# EAGLE design RS232 Loopback (EAGLE 9.6.2)
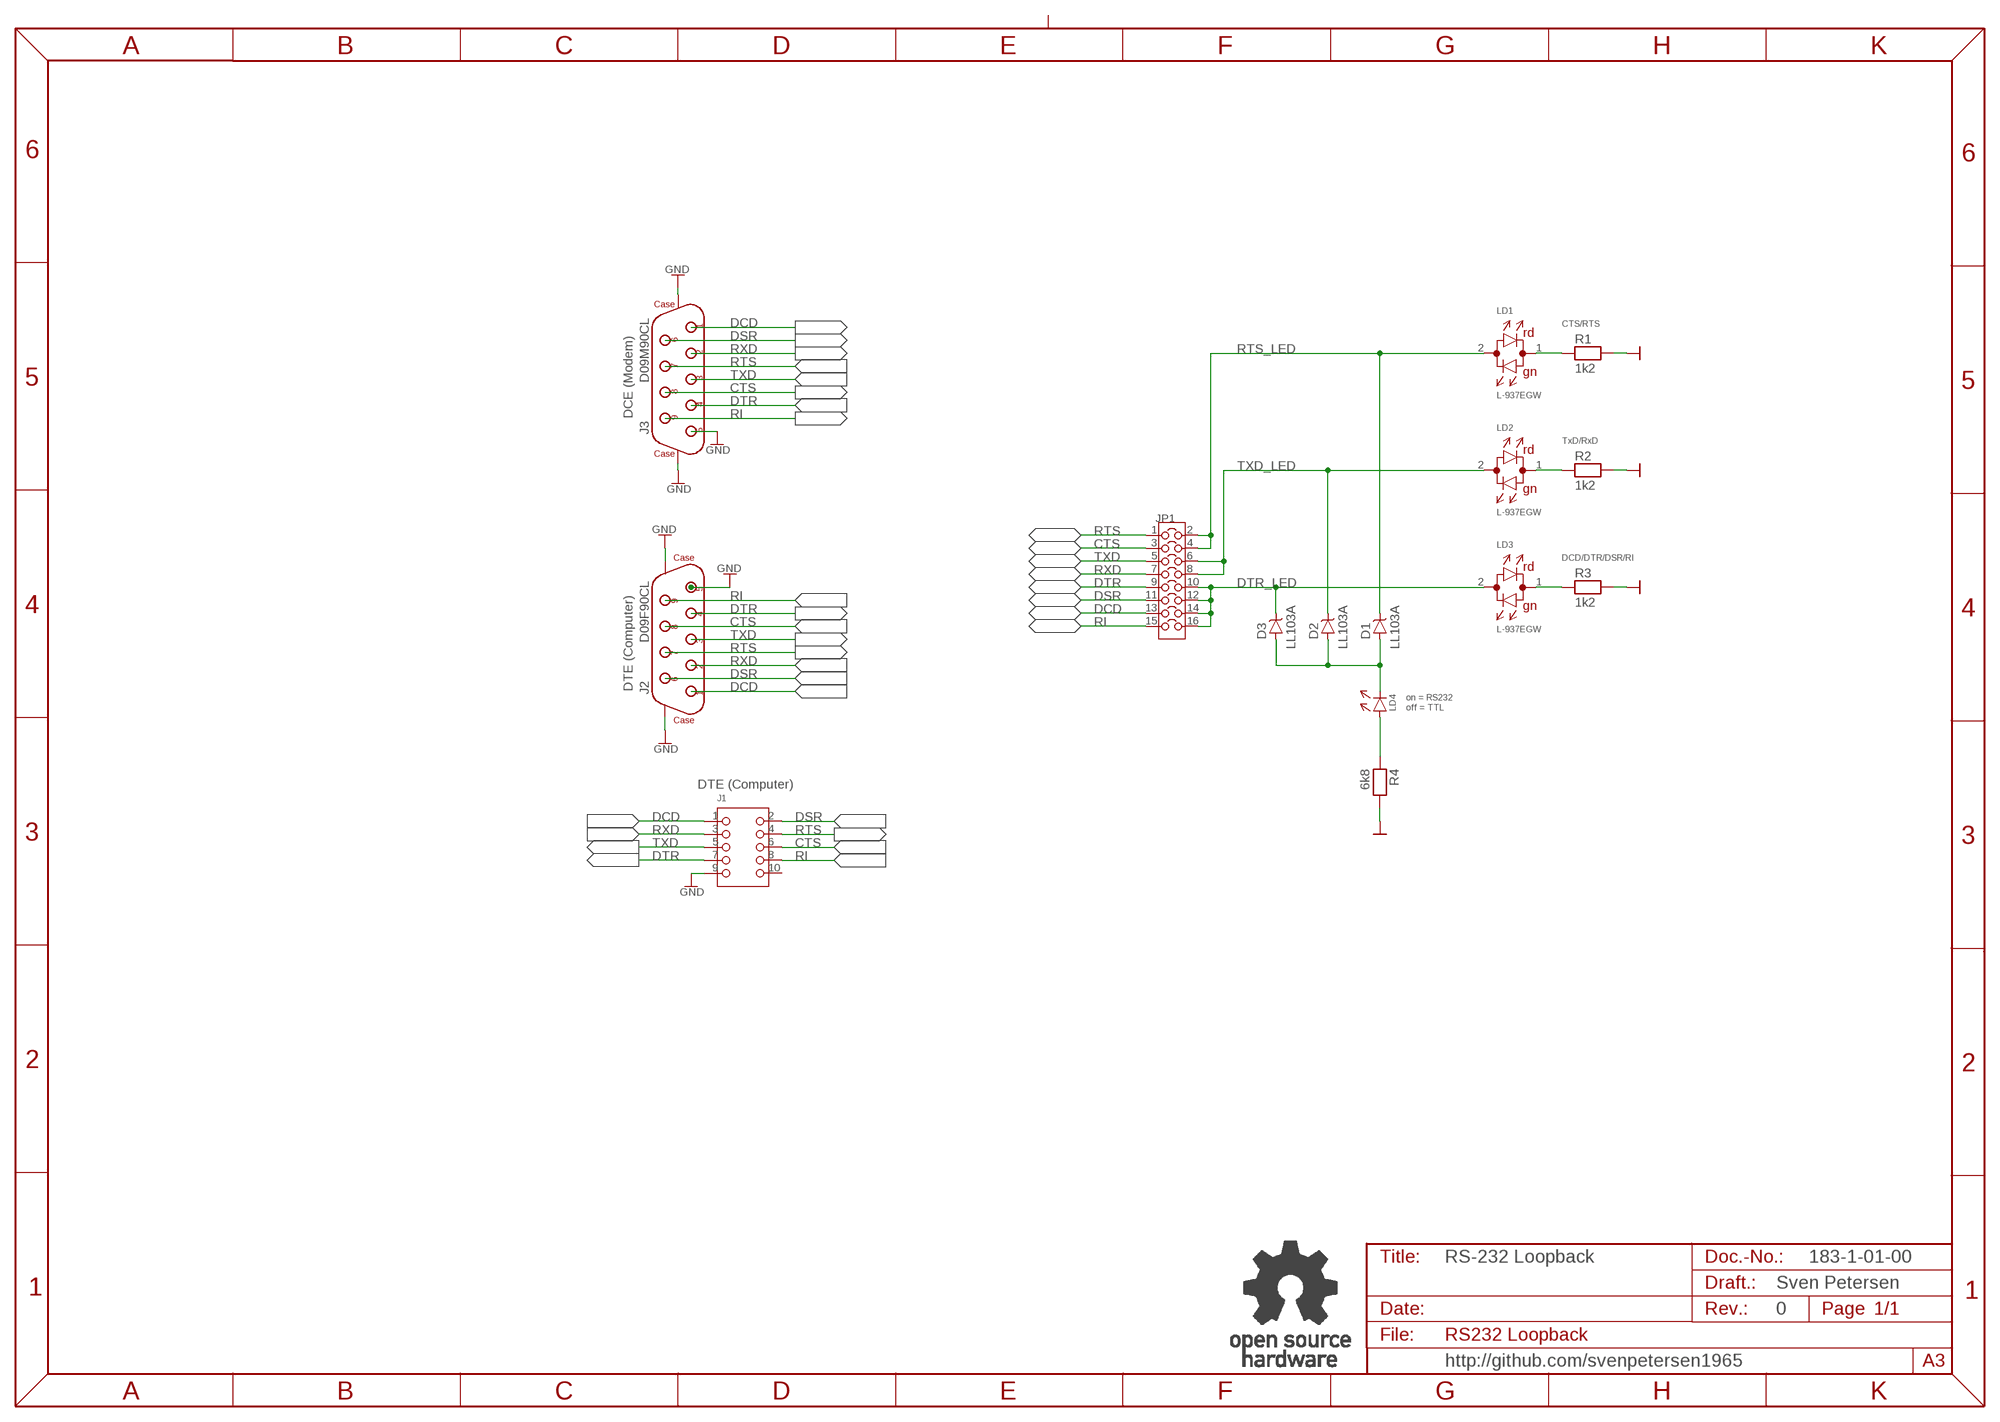
[diagram p0: schematic, sheet 1]

## Parts
D1  LL103A  [SOD80C]
D2  LL103A  [SOD80C]
D3  LL103A  [SOD80C]
J1  2X05WV  [2X05WV]
J2  D09F90CL  [D09F90CL]
J3  D09M90CL  [D09M90CL]
JP1  COMBI-8X2P  [COMBI-8X2]
LD1  L-937EGW  [LED_3MM_BICOLOR]
LD2  L-937EGW  [LED_3MM_BICOLOR]
LD3  L-937EGW  [LED_3MM_BICOLOR]
LD4  3MM  [3MM]
R1  1k2  R-0805  [0805]
R2  1k2  R-0805  [0805]
R3  1k2  R-0805  [0805]
R4  6k8  R-0805  [0805]
U$44  OPEN_SOURCE_HW  [OPENHW]

## Nets
CTS: J1.6 J2.8 J3.8 JP1.3
DCD: J1.1 J2.1 J3.1 JP1.13
DSR: J1.2 J2.6 J3.6 JP1.11
DTR: J1.7 J2.4 J3.4 JP1.9
DTR_LED: D3.K JP1.10 JP1.12 JP1.14 JP1.16 LD3.2
GND: J1.9 J2.5 J2.CL1(CASE1) J2.CL2(CASE2) J3.5 J3.CL1(CASE1) J3.CL2(CASE2) R1.2 R2.2 R3.2 R4.2
N$4: D1.A D2.A D3.A LD4.C(K)
N$7: LD4.A R4.1
N$8: LD1.1 R1.1
N$9: LD2.1 R2.1
N$10: LD3.1 R3.1
RI: J1.8 J2.9 J3.9 JP1.15
RTS: J1.4 J2.7 J3.7 JP1.1
RTS_LED: D1.K JP1.2 JP1.4 LD1.2
RXD: J1.3 J2.2 J3.2 JP1.7
TXD: J1.5 J2.3 J3.3 JP1.5
TXD_LED: D2.K JP1.6 JP1.8 LD2.2
Unconnected: J1.10

## Notes on the sheet
- CTS/RTS
- DCE (Modem)
- TxD/RxD
- DCD/DTR/DSR/RI
- DTE (Computer)
- on = RS232
  off = TTL
- DTE (Computer)
- RS-232 Loopback | 183-1-01-00
- Sven Petersen
- 0
- http://github.com/svenpetersen1965

## Library data of the parts
D1-D3 = Dioden:LL103A
J1 = PINHEAD:2X05WV
J2 = Connect:D09F90CL
J3 = Connect:D09M90CL
JP1 = Cutpad:COMBI-8X2P
LD1-LD3 = Kingbright:L-937EGW
LD4 = LED:3MM
R1-R4 = SMD:R-0805
U$44 = Logo:OPEN_SOURCE_HW

## Board
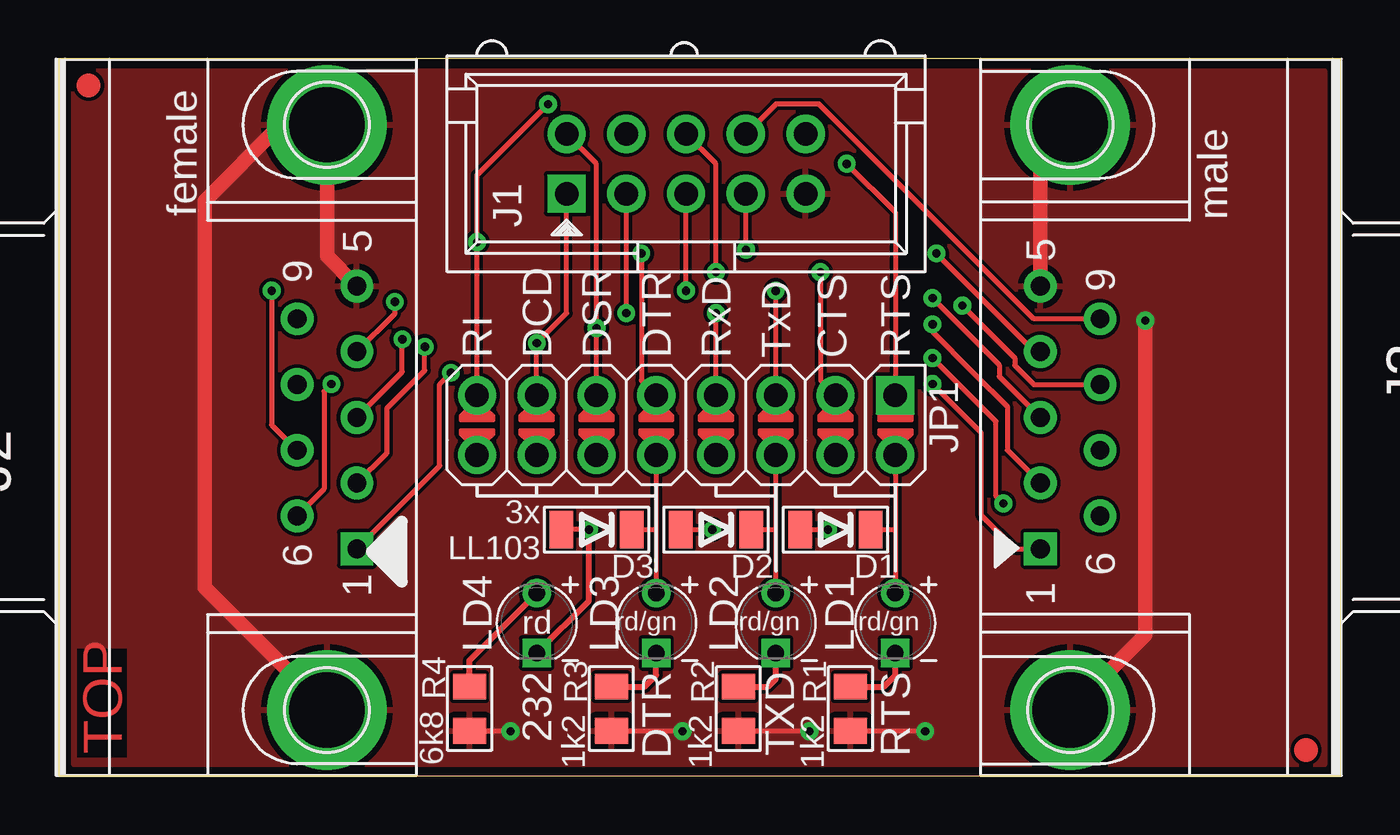
[diagram p1: board, top side]
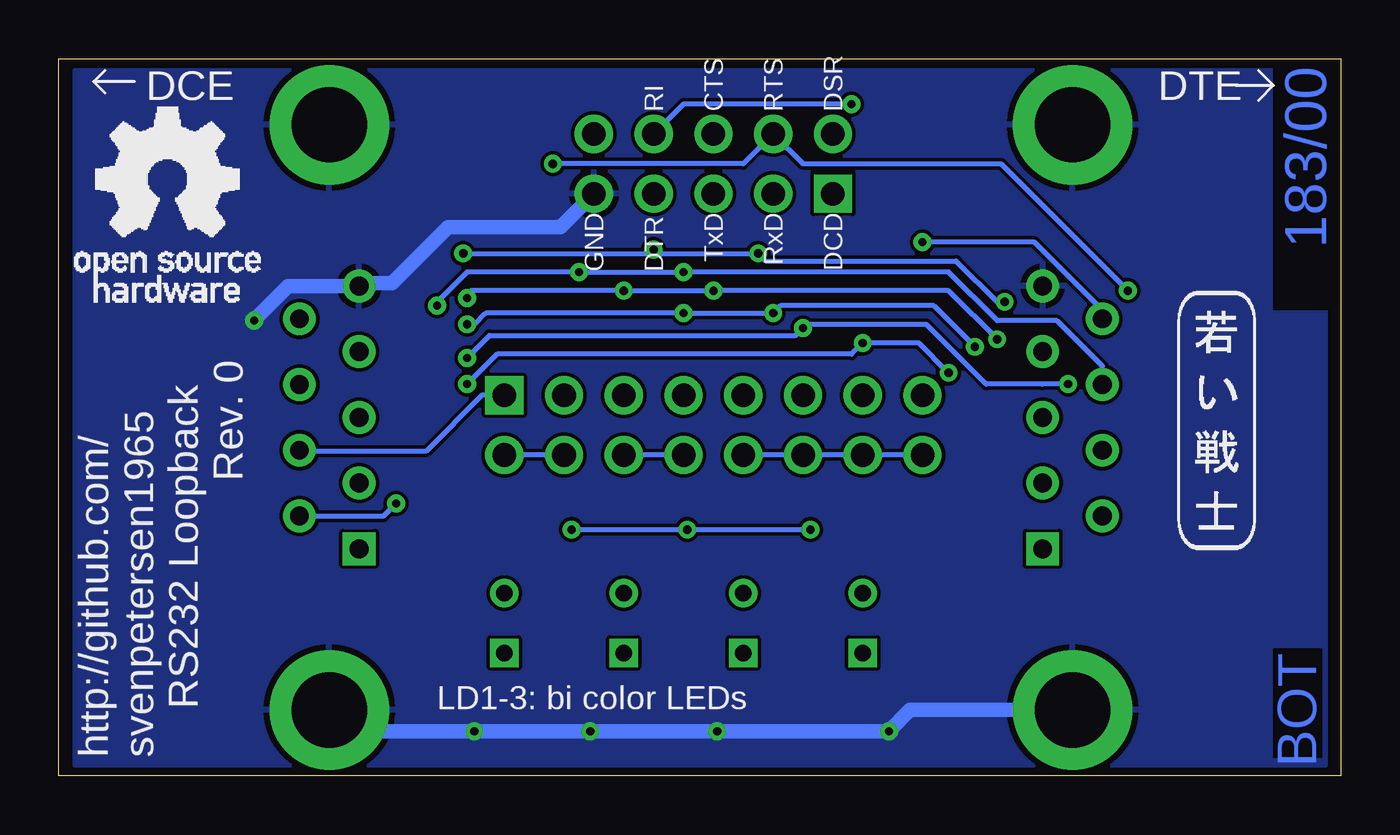
[diagram p2: board, bottom side, seen from below]

Size 54.5 x 30.5 mm. Coordinates in mm from the lower left corner, seen from the top.
Outline: 0,0 54.5,0 54.5,30.5 0,30.5 0,0
Copper layers (1*16): Top 0.035mm / dielectric 1.5mm / Bottom 0.035mm
Design rules "default *": minimum track width 6mil, minimum drill 0.35mm, track to track 6mil, track to pad 6mil, pad to pad 6mil, via to via 6mil, smd to smd 6mil, copper to edge 0mil, drill to drill 6mil, minimum pad ring 10mil, minimum via ring 8mil, stop-mask expansion 4mil, vias tented up to drill 25mil, thermal gap 10mil
bRestrict: 2 lines

### Footprints (pad centres in the part's own frame; a part is rotated, then mirrored left to right if it is on the bottom)
SOD80C = smd 1 x 1.6: A -1.5,0; K 1.5,0
2X05WV = drill 1 pad 1.626 square: 1 -5.08,-1.27 | drill 1 pad 1.626: 2 -5.08,1.27; 3 -2.54,-1.27; 4 -2.54,1.27; 5 0,-1.27; 6 0,1.27; 7 2.54,-1.27; 8 2.54,1.27; 9 5.08,-1.27; 10 5.08,1.27
D09F90CL = drill 0.8 pad 1.397 square: 1 -5.588,-1.27 | drill 0.8 pad 1.397: 2 -2.794,-1.27; 3 0,-1.27; 4 2.794,-1.27; 5 5.588,-1.27; 6 -4.191,1.27; 7 -1.397,1.27; 8 1.397,1.27; 9 4.191,1.27 | drill 3.2 pad 5.08: CL1 12.446,0; CL2 -12.446,0
D09M90CL = drill 0.8 pad 1.397 square: 1 5.588,-1.27 | drill 0.8 pad 1.397: 2 2.794,-1.27; 3 0,-1.27; 4 -2.794,-1.27; 5 -5.588,-1.27; 6 4.191,1.27; 7 1.397,1.27; 8 -1.397,1.27; 9 -4.191,1.27 | drill 3.2 pad 5.08: CL1 12.446,0; CL2 -12.446,0
COMBI-8X2 = drill 1 pad 1.626 square: 1 -1.27,8.89 | drill 1 pad 1.626: 2 1.27,8.89; 3 -1.27,6.35; 4 1.27,6.35; 5 -1.27,3.81; 6 1.27,3.81; 7 -1.27,1.27; 8 1.27,1.27; 9 -1.27,-1.27; 10 1.27,-1.27; 11 -1.27,-3.81; 12 1.27,-3.81; 13 -1.27,-6.35; 14 1.27,-6.35; 15 -1.27,-8.89; 16 1.27,-8.89
LED_3MM_BICOLOR = drill 0.7 square: 1 1.27,0 | drill 0.7: 2 -1.27,0
3MM = drill 0.7: A -1.27,0 | drill 0.7 square: C 1.27,0
0805 = smd 1.092 x 1.397: 1 -0.94,0; 2 0.94,0

### Placement (x,y rotation side)
D1  33.02,10.48 0 top
D2  27.94,10.48 0 top
D3  22.86,10.48 0 top
J1  26.67,26.04 0 top
J2  11.4,15.25 90 top
J3  43,15.25 270 top
JP1  26.67,14.92 270 top
LD1  35.56,6.5 270 top
LD2  30.48,6.5 270 top
LD3  25.4,6.5 270 top
LD4  20.32,6.5 270 top
R1  33.66,2.86 270 top
R2  28.89,2.86 270 top
R3  23.5,2.86 270 top
R4  17.46,2.86 270 top
U$2  [2LAYER]  2.7,0.95 90 top
U$3  [SMD_REF_R1MM]  1.27,29.37 90 top
U$43  [SMD_REF_R1MM]  53.02,1.11 90 top
U$44  53.82,20.16 0 bottom
U$45  [PCB-TITLE/]  0,38.1 0 top  (outside the outline)
U$46  [SVEN_TAG]  5.24,15.24 0 bottom

### Tracks (layer width: path | path; a pad name or v marks a point on that pad's centre or on a via)
CTS  (via drill 0.35)
  Top 0.203: v32.38,21.43 32.38,16.83 JP1.3 | J1.6 27.94,26.04 v27.94,21.43 | v38.42,20 40.64,17.78 40.64,17.46 41.46,16.65 J3.8
  Bottom 0.203: J2.8 10.13,17.43 12.06,19.37 14.61,19.37 16.67,21.43 v27.94,21.43 v32.38,21.43 37.15,21.43 38.42,20.16 v38.42,20
DCD  (via drill 0.35)
  Top 0.203: JP1.13 v20.32,18.41 21.59,19.68 J1.1 | v37.15,16.67 39.21,14.61 39.21,11.11 40.66,9.66 J3.1 | J2.1 16.19,13.18 16.19,16.67 v16.67,17.14
  Bottom 0.203: v37.15,16.67 35.88,17.94 20.8,17.94 v20.32,18.41 17.94,18.41 v16.67,17.14
DSR  (via drill 0.35)
  Top 0.203: JP1.11 v22.86,19.05 22.86,26.04 J1.2 | v40.16,11.59 39.85,11.91 39.85,15.08 v37.15,17.78 | J2.6 11.27,12.2 11.27,16.35 v11.59,16.67
  Bottom 0.203: J3.6 40.69,11.06 v40.16,11.59 | v37.15,17.78 36.2,18.73 23.18,18.73 v22.86,19.05 22.7,19.21 17.62,19.21 15.08,16.67 12.7,16.67 v11.59,16.67
DTR  (via drill 0.35)
  Top 0.203: v24.77,22.23 24.77,16.83 JP1.9 | v29.21,22.38 J1.7 | v37.31,22.23 41.49,18.04 J3.4 | J2.4 14.29,19.66 v14.29,20.16
  Bottom 0.203: v37.31,22.23 29.37,22.23 v29.21,22.38 29.05,22.23 v24.77,22.23 24.45,21.91 16.35,21.91 14.61,20.16 v14.29,20.16
DTR_LED
  Top 0.203: JP1.10 25.4,10.48 | 25.4,10.48 LD3.2 | D3.K 25.4,10.48
  Bottom 0.203: JP1.16 JP1.14 JP1.12 JP1.10
GND  (via drill 0.35)
  Top 0.203: R4.2 19.2,1.92 v19.21,1.91 | R3.2 26.5,1.92 v26.51,1.91 | R2.2 31.9,1.92 v31.91,1.91 | R1.2 36.82,1.92 v36.83,1.91
  Top 0.61: J2.5 11.4,22.11 J2.CL1 9.44,27.7 6.19,24.45 6.19,8.01 J2.CL2 | J3.5 41.73,22.54 41.73,26.43 J3.CL2 | J3.CL1 46.2,6 v46.2,19.37
  Bottom 0.61: J1.9 33.18,23.34 37.94,23.34 40.32,20.95 41.85,20.95 J3.5 44.75,20.84 46.2,19.39 v46.2,19.37 | J2.CL2 18.31,2.8 v19.21,1.91 23.5,1.91 v26.51,1.91 v31.91,1.91 33.81,1.91 v36.83,1.91 42.1,1.91 J3.CL1
  pour Bottom: 0.64,30 53.82,30 53.82,0.48 0.64,0.48
  pour Top: 0.64,30 53.82,30 53.82,0.48 0.64,0.48
N$4  (via drill 0.35)
  Top 0.203: D1.A v32.7,10.48 | v22.54,10.48 D3.A | D2.A v27.78,10.48
  Top 0.254: LD4.C 22.54,7.45 v22.54,10.48
  Bottom 0.203: v32.7,10.48 v27.78,10.48 v22.54,10.48
N$7
  Top 0.254: R4.1 17.46,4.91 LD4.A
N$8
  Top 0.254: R1.1 35.07,3.8 35.56,4.29 LD1.1
N$9
  Top 0.254: R2.1 30.15,3.8 30.48,4.13 LD2.1
N$10
  Top 0.254: R3.1 24.91,3.8 25.4,4.29 LD3.1
RI  (via drill 0.35)
  Top 0.203: JP1.15 v17.78,22.7 17.78,25.56 v20.8,28.57 | J3.9 41.46,19.44 32.33,28.57 30.48,28.57 J1.8
  Bottom 0.203: v20.8,28.57 27.94,28.57 J1.8 | J2.9 10.13,19.81 13.02,22.7 v17.78,22.7
RTS  (via drill 0.35)
  Top 0.203: v33.5,26.04 35.56,23.97 JP1.1 | v9.05,20.64 9.05,14.93 J2.7
  Bottom 0.203: v33.5,26.04 25.4,26.04 J1.4 22.86,26.04 14.45,26.04 v9.05,20.64 | JP1.1 36.51,16.19 38.89,13.81 44.23,13.81 J3.7
RTS_LED
  Top 0.203: JP1.2 35.56,10.48 | 35.56,10.48 LD1.2 | D1.K 35.56,10.48
  Bottom 0.203: JP1.4 JP1.2
RXD  (via drill 0.35)
  Top 0.203: JP1.7 v27.94,19.68 | v24.13,19.68 J1.3 | v37.15,19.21 37.15,18.89 38.89,17.14 40.32,15.72 40.32,13.86 J3.2 | J2.2 13.94,13.73 13.94,15.63 15.56,17.25 v15.56,18.26
  Bottom 0.203: v37.15,19.21 36.83,19.21 36.35,19.68 v27.94,19.68 v24.13,19.68 23.81,20 17.3,20 v15.56,18.26
TXD  (via drill 0.35)
  Top 0.203: JP1.5 v30.48,20.64 | v26.67,20.64 J1.5 | v37.15,20.32 39.69,17.78 39.98,17.48 39.98,17 J3.3 | J2.3 14.61,17.18 v14.61,18.57
  Bottom 0.203: v37.15,20.32 37.15,20.48 36.99,20.64 v30.48,20.64 v26.67,20.64 16.67,20.64 v14.61,18.57
TXD_LED
  Top 0.203: LD2.2 30.48,10.48 | 30.48,10.48 JP1.6 | D2.K 30.48,10.48
  Bottom 0.203: JP1.8 JP1.6

### Text on the board
Bottom: 183/00
tPlace: female | male | 232 | DTR | TXD | RTS | 6k8 | 1k2 | 1k2 | 1k2
bPlace: DTE | DCE | DSR | RTS | CTS | RI | DCD | RxD | TxD | DTR | GND | Rev. 0 | LD1-3: bi color LEDs | RS232 Loopback | http://github.com/ / svenpetersen1965
tNames: RI | DCD | DSR | DTR | RxD | TxD | CTS | RTS | 3x / LL103 | rd | rd/gn | rd/gn | rd/gn
Document: 183-2-01-00 | Sven Petersen | 2022 | 35µm | 2 | 0